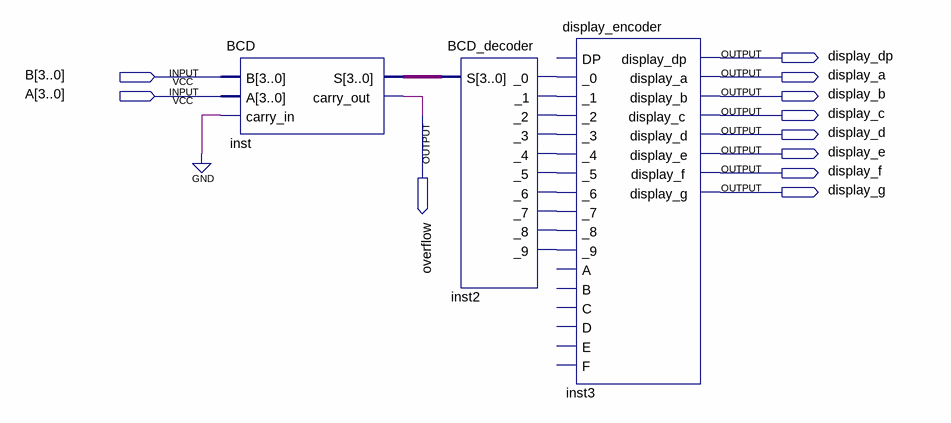
[diagram p0: schematic sheet]
// Quartus schematic placa_BCD.bdf as structural Verilog: 3 symbols, 11 pins
module placa_BCD (
  input  [3:0] B,
  input  [3:0] A,
  output display_dp,
  output display_a,
  output display_b,
  output overflow,
  output display_c,
  output display_d,
  output display_e,
  output display_f,
  output display_g
);

  wire inst2__0, inst2__1, inst2__2, inst2__3, inst2__4, inst2__5, inst2__6, inst2__7, inst2__8, inst2__9;
  wire [3:0] inst_s;

  BCD inst (.B(B), .A(A), .carry_in(1'b0), .S(inst_s), .carry_out(overflow));
  BCD_decoder inst2 (
    .S(inst_s), ._0(inst2__0), ._1(inst2__1), ._2(inst2__2), ._3(inst2__3), ._4(inst2__4), ._5(inst2__5),
    ._6(inst2__6), ._7(inst2__7), ._8(inst2__8), ._9(inst2__9));
  display_encoder inst3 (
    ._0(inst2__0), ._1(inst2__1), ._2(inst2__2), ._3(inst2__3), ._4(inst2__4), ._5(inst2__5), ._6(inst2__6),
    ._7(inst2__7), ._8(inst2__8), ._9(inst2__9), .display_dp(display_dp), .display_a(display_a),
    .display_b(display_b), .display_c(display_c), .display_d(display_d), .display_e(display_e),
    .display_f(display_f), .display_g(display_g));  // open: DP, A, B, C, D, E, F
endmodule
